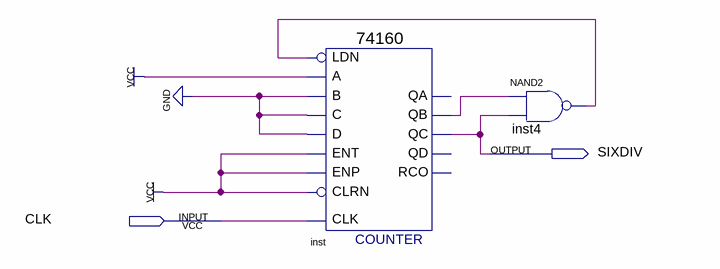
[diagram p0: schematic sheet]
// Quartus schematic 6FENPING.bdf as structural Verilog: 2 symbols, 2 pins
module \6FENPING  (
  input  CLK,
  output SIXDIV
);

  wire inst4_out, inst_qb;

  \74160  inst (
    .CLK(CLK), .ENT(1'b1), .A(1'b1), .B(1'b0), .C(1'b0), .D(1'b0), .LDN(inst4_out), .ENP(1'b1), .CLRN(1'b1),
    .QB(inst_qb), .QC(SIXDIV));  // open: QD, QA, RCO
  nand inst4 (inst4_out, inst_qb, SIXDIV);
endmodule
